# EasyEDA Pro project ProProject_工科大_2023-11-10.epro, schematic driver
Create Date: 2023-09-30; Page Name: P1; Project Name: 工科大; Schematic Name: driver; Update Date: 2023-10-13; Company: 嘉立创EDA; Page Size: A4; Version: V1.0
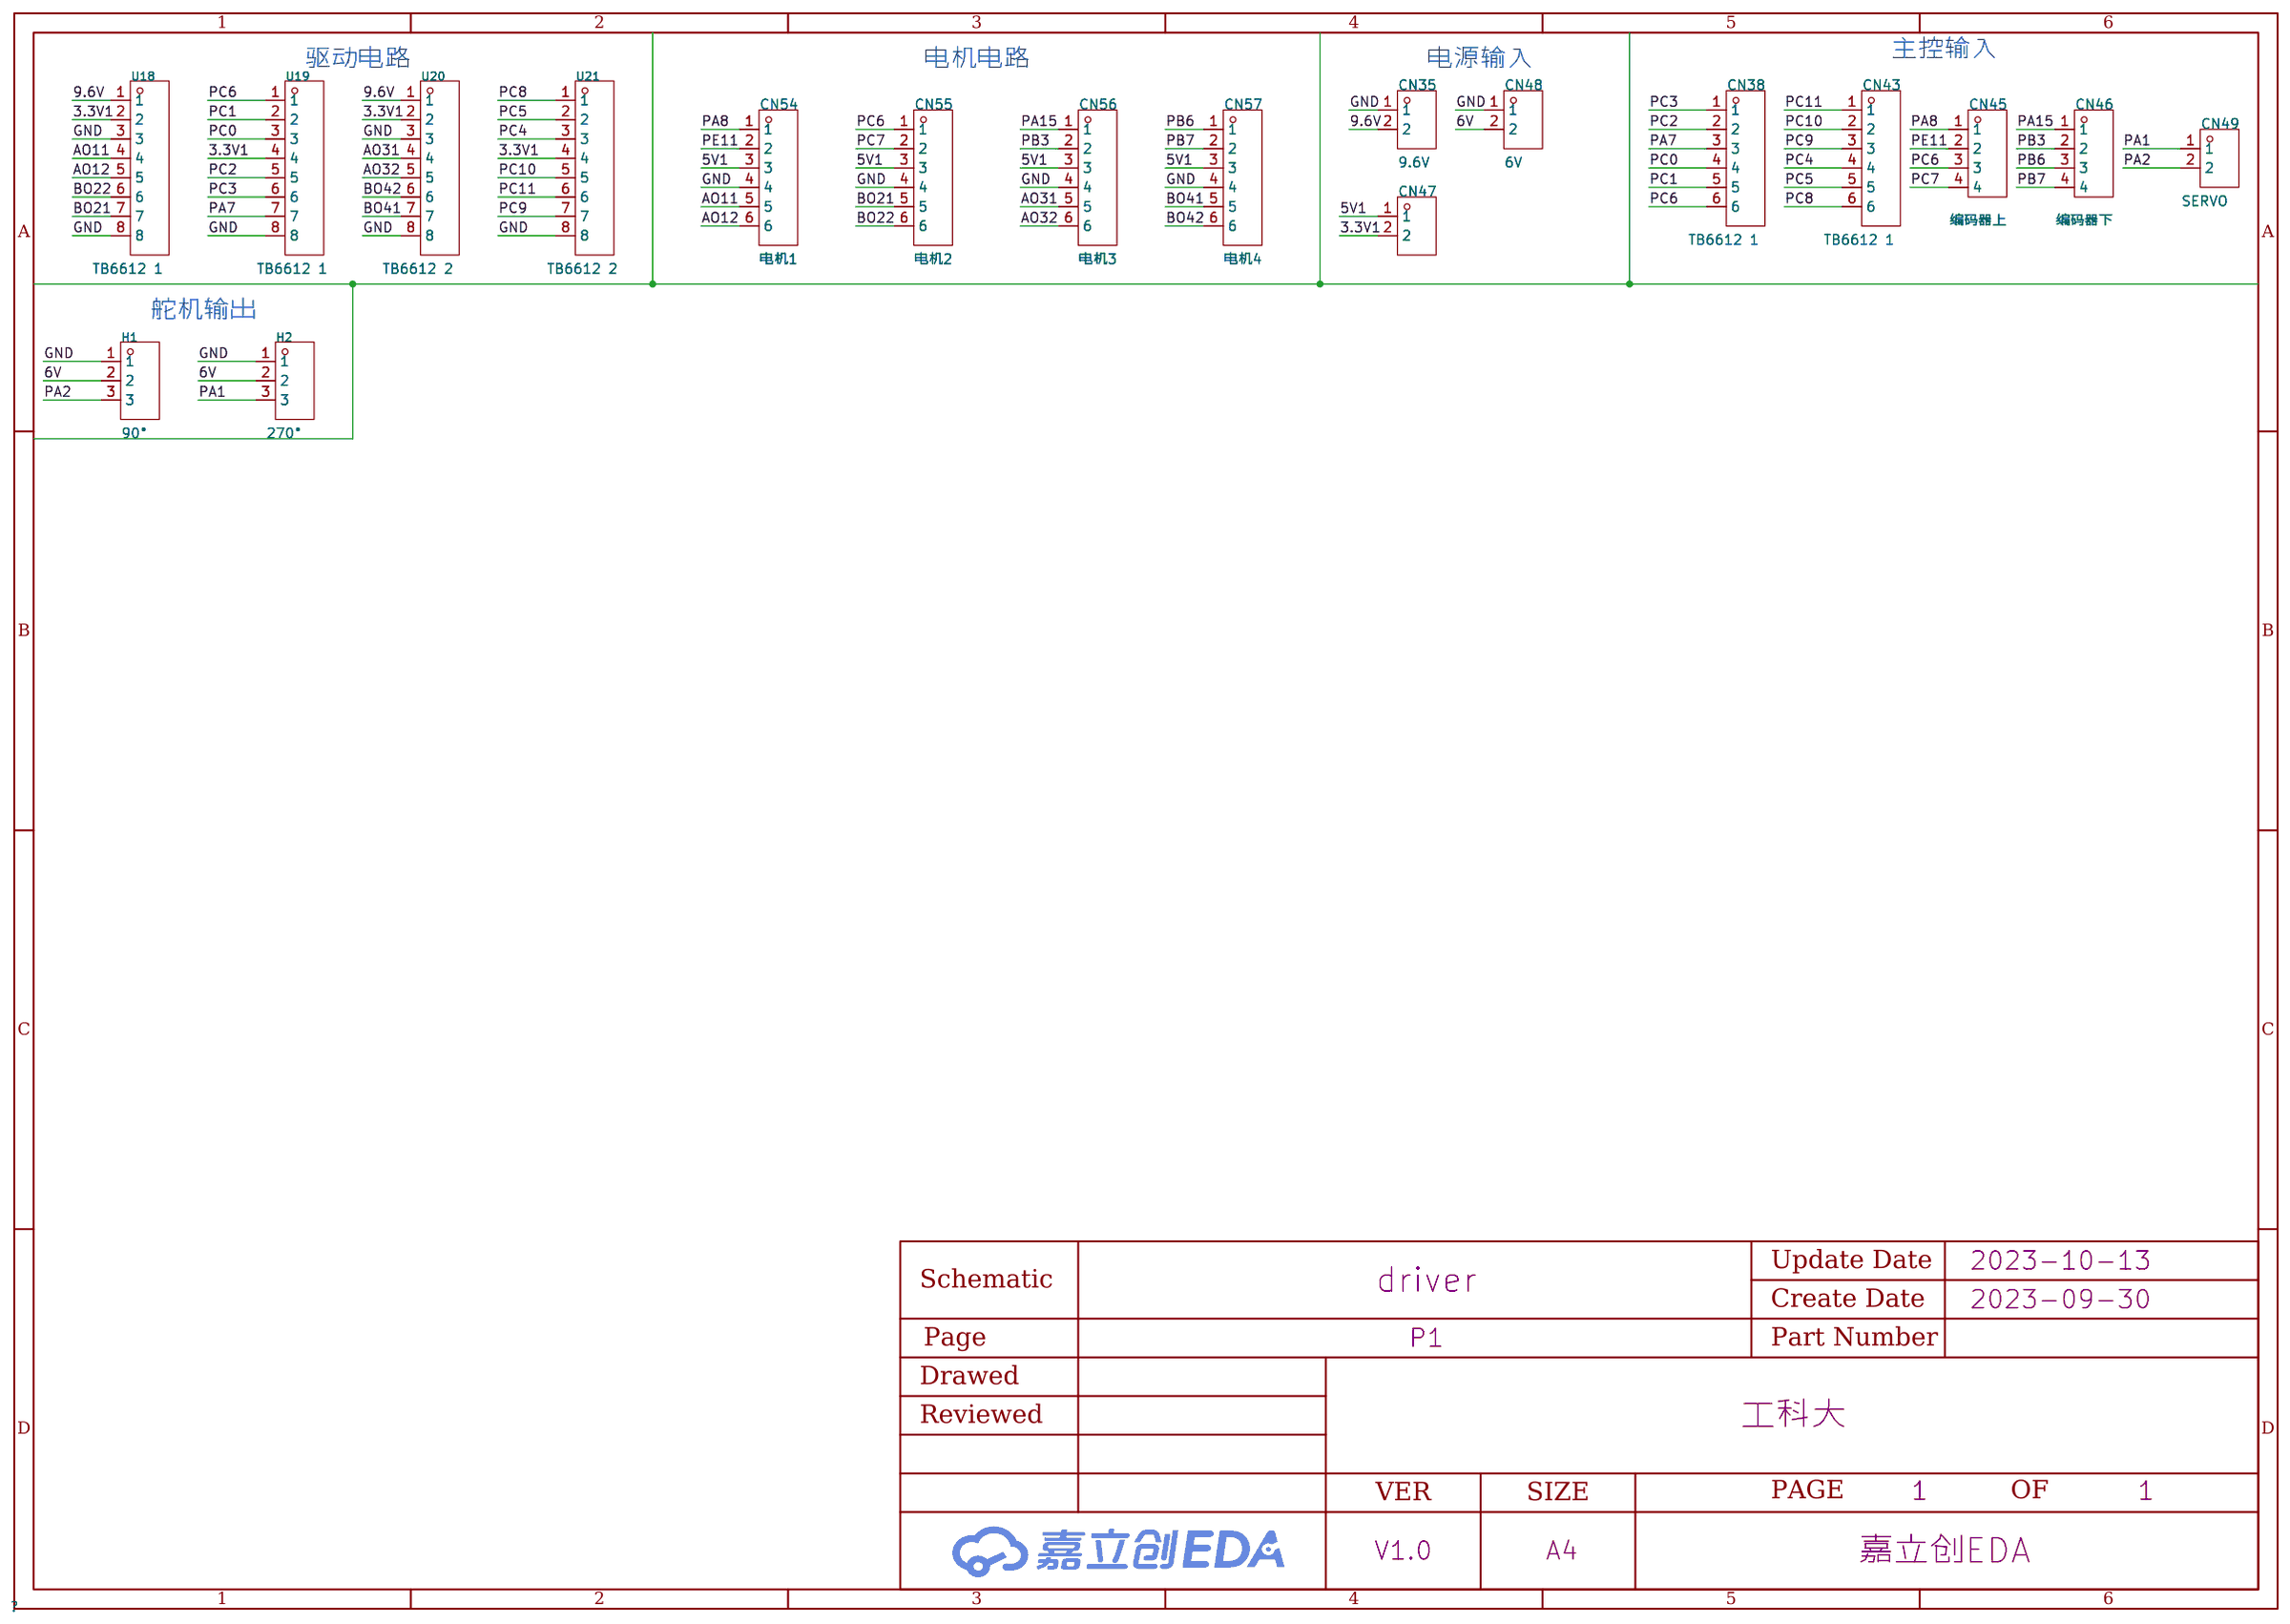
[diagram p1: schematic sheet]

## Parts
CN35  9.6V  [CONN-TH_XH-2AW_C2908611]
CN38  TB6612 1  [CONN-TH_6P-P2.50_HC-XH-6AW-G]
CN43  TB6612 1  [CONN-TH_6P-P2.50_HC-XH-6AW-G]
CN45  编码器上  [CONN-TH_XH-4AW]
CN46  编码器下  [CONN-TH_XH-4AW]
CN47  XH-2AW  [CONN-TH_XH-2AW_C2908611]
CN48  6V  [CONN-TH_XH-2AW_C2908611]
CN49  SERVO  [CONN-TH_XH-2AW_C2908611]
CN54  电机1  [CONN-TH_6P-P2.00_HX20007-6WAP]
CN55  电机2  [CONN-TH_6P-P2.00_HX20007-6WAP]
CN56  电机3  [CONN-TH_6P-P2.00_HX20007-6WAP]
CN57  电机4  [CONN-TH_6P-P2.00_HX20007-6WAP]
H1  90°  [HDR-TH_3P-P2.54-H-M-BW7.2-P]
H2  270°  [HDR-TH_3P-P2.54-H-M-BW7.2-P]
U18  TB6612 1  [HDR-TH_8P-P2.54-V-F]
U19  TB6612 1  [HDR-TH_8P-P2.54-V-F]
U20  TB6612 2  [HDR-TH_8P-P2.54-V-F]
U21  TB6612 2  [HDR-TH_8P-P2.54-V-F]

## Library data of the parts
CN35 CN47-CN49 = XH-2AW_C2908611: 参考系列:XH;间距:2.54mm;插针结构:1x2P;排数:1;每排PIN数:2;行距:-;公母:公型插针;安装方式:弯插;额定电流:3A;工作温度范围:-25℃~+85℃;; LCSC Part Name: XH 2.54mm 1x2P 弯插; Supplier Part: C2908611; Manufacturer: HCTL(华灿天禄); Supplier Footprint: 弯插,P=2.54mm; JLCPCB Part Class: 扩展库; Datasheet: https://atta.szlcsc.com/upload/public/pdf/source/20211021/ACA2D54D99493880102FCACAC8DAABA8.pdf; Supplier: LCSC; Reference Series: XH; Pitch: 2.54mm; Pins Structure: 1x2P; Number of Rows: 1; Number of PINs Per Row: 2; Gender: 公型插针; Mounting Style: 弯插; Current Rating (Max): 3A; Operating Temperature Range: -25℃~+85℃
CN38 CN43 = HC-XH-6AW-G: 参考系列:XH;间距:2.54mm;插针结构:1x6P;排数:1;每排PIN数:6;行距:2.54mm;公母:公型插针;安装方式:弯插;额定电流:3A;工作温度范围:-25℃~+85℃;; LCSC Part Name: XH 2.54mm 1x6P 弯插; Supplier Part: C5341212; Manufacturer: HCTL(华灿天禄); Supplier Footprint: 弯插,P=2.5mm; JLCPCB Part Class: 扩展库; Datasheet: https://atta.szlcsc.com/upload/public/pdf/source/20230105/4FFD2EFD3DA44AA828171A44400F3EDE.pdf; Supplier: LCSC; Reference Series: XH; Pitch: 2.54mm; Pins Structure: 1x6P; Number of Rows: 1; Number of PINs Per Row: 6; Row Spacing: 2.54mm; Gender: 公型插针; Mounting Style: 弯插; Current Rating (Max): 3A; Operating Temperature Range: -25℃~+85℃
CN45 CN46 = XH-4AW: 参考系列:XH;间距:2.54mm;插针结构:1x4P;排数:1;每排PIN数:4;行距:-;公母:公型插针;安装方式:弯插;额定电流:3A;工作温度范围:-25℃~+85℃;; LCSC Part Name: XH 2.54mm 1x4P 弯插; Supplier Part: C2908613; Manufacturer: HCTL(华灿天禄); Supplier Footprint: 插件,P=2.54mm; JLCPCB Part Class: 扩展库; Datasheet: https://atta.szlcsc.com/upload/public/pdf/source/20211021/ACA2D54D99493880102FCACAC8DAABA8.pdf; Supplier: LCSC; Reference Series: XH; Pitch: 2.54mm; Pins Structure: 1x4P; Number of Rows: 1; Number of PINs Per Row: 4; Gender: 公型插针; Mounting Style: 弯插; Current Rating (Max): 3A; Operating Temperature Range: -25℃~+85℃
CN54-CN57 = HX20007-6WAP: 参考系列:PH;间距:2mm;插针结构:1x6P;排数:1;每排PIN数:6;行距:-;公母:公型插针;安装方式:弯插;额定电流:-;工作温度范围:-;; LCSC Part Name: PH 2mm 1x6P 弯插 母座; Supplier Part: C442204; Manufacturer: HX(红星); Supplier Footprint: 插件,P=2mm; JLCPCB Part Class: 扩展库; Datasheet: https://atta.szlcsc.com/upload/public/pdf/source/20191028/C442204_14307C9B693F4936F9E5658D4D3BBF2C.pdf; Supplier: LCSC; Reference Series: PH; Pitch: 2mm; Pins Structure: 1x6P; Number of Rows: 1; Number of PINs Per Row: 6; Gender: 公型插针; Mounting Style: 弯插
H1 H2 = 2.54-1*3P正弯针: 排数:单排;总PIN位数:3P;间距:2.54mm;插针结构:1x3P;行距:-;安装类型:弯插;圆针/方针:方针;额定电流:3A;额定电压:-;配合针长度:3mm;塑高:2.54mm;端接针长度:-;触头材质:-;触头镀层:-;工作温度范围:-55℃~+105℃;颜色:黑色;; LCSC Part Name: 2.54mm 1x3P 弯插 方针; Supplier Part: C92159; Manufacturer: BOOMELE(博穆精密); Supplier Footprint: 弯插,P=2.54mm; JLCPCB Part Class: 扩展库; Datasheet: https://atta.szlcsc.com/upload/public/pdf/source/20181121/C2334_B051029C4931EB562F9DCCAAD18AC88A.pdf; Supplier: LCSC; Number of Rows: 单排; Number of Pins: 3P; Pitch: 2.54mm; Pin Structure: 1x3P; Mounting Type: 弯插; Circluar Pins/Square Pins: 方针; Current Rating (Max): 3A; Length of Mating Pin: 3mm; Insulation Height: 2.54mm; Operating Temperature Range: -55℃~+105℃; Color: 黑色
U18-U21 = PM254-1-08-Z-8.5: 排数:单排;总孔位数:8P;间距:2.54mm;插孔结构:1x8P;行距:-;安装类型:直插;圆孔/方孔:方孔;额定电流:3A;额定电压:-;插孔方向:顶部;塑高:8.5mm;工作温度范围:-40℃~+105℃;; LCSC Part Name: 2.54mm 1x8P; Supplier Part: C2897371; Manufacturer: HCTL(华灿天禄); Supplier Footprint: 插件,P=2.54mm; JLCPCB Part Class: 扩展库; Datasheet: https://atta.szlcsc.com/upload/public/pdf/source/20230609/534BE42964C679BDE98E061007C4ABD6.pdf; Supplier: LCSC; Number of Rows: 单排; Number of Holes: 8P; Pitch: 2.54mm; Holes Structure: 1x8P; Mounting Type: 直插; Circular Hole / Square Hole: 方孔; Current Rating (Max): 3A; Holes Direction: 顶部; Insulation Height: 8.5mm; Operating Temperature Range: -40℃~+105℃

## Nets
3.3V1: CN47.2 U18.2 U19.4 U20.2 U21.4
5V1: CN47.1 CN54.3 CN55.3 CN56.3 CN57.3
6V: CN48.2 H1.2 H2.2
9.6V: CN35.2 U18.1 U20.1
GND: CN35.1 CN48.1 CN54.4 CN55.4 CN56.4 CN57.4 H1.1 H2.1 U18.3 U18.8 U19.8 U20.3 U20.8 U21.8
AO11: CN54.5 U18.4
AO12: CN54.6 U18.5
AO31: CN56.5 U20.4
AO32: CN56.6 U20.5
BO21: CN55.5 U18.7
BO22: CN55.6 U18.6
BO41: CN57.5 U20.7
BO42: CN57.6 U20.6
PA1: CN49.1 H2.3
PA2: CN49.2 H1.3
PA7: CN38.3 U19.7
PA8: CN45.1 CN54.1
PA15: CN46.1 CN56.1
PB3: CN46.2 CN56.2
PB6: CN46.3 CN57.1
PB7: CN46.4 CN57.2
PC0: CN38.4 U19.3
PC1: CN38.5 U19.2
PC2: CN38.2 U19.5
PC3: CN38.1 U19.6
PC4: CN43.4 U21.3
PC5: CN43.5 U21.2
PC6: CN38.6 CN45.3 CN55.1 U19.1
PC7: CN45.4 CN55.2
PC8: CN43.6 U21.1
PC9: CN43.3 U21.7
PC10: CN43.2 U21.5
PC11: CN43.1 U21.6
PE11: CN45.2 CN54.2

## Notes on the sheet
- 主控输入
- 驱动电路
- 电机电路
- 电源输入
- 舵机输出
